# Altium schematic sheet 25_Clocks_1.SchDoc: Clocks 1
size A3; Organization: Lime Microsystems; Address1: Surrey Tech Centre; Address2: Guildford GU2 7YG; Address3: Surrey; Address4: United Kingdom; Revision: v1.2; SheetNumber: 23; SheetTotal: 27
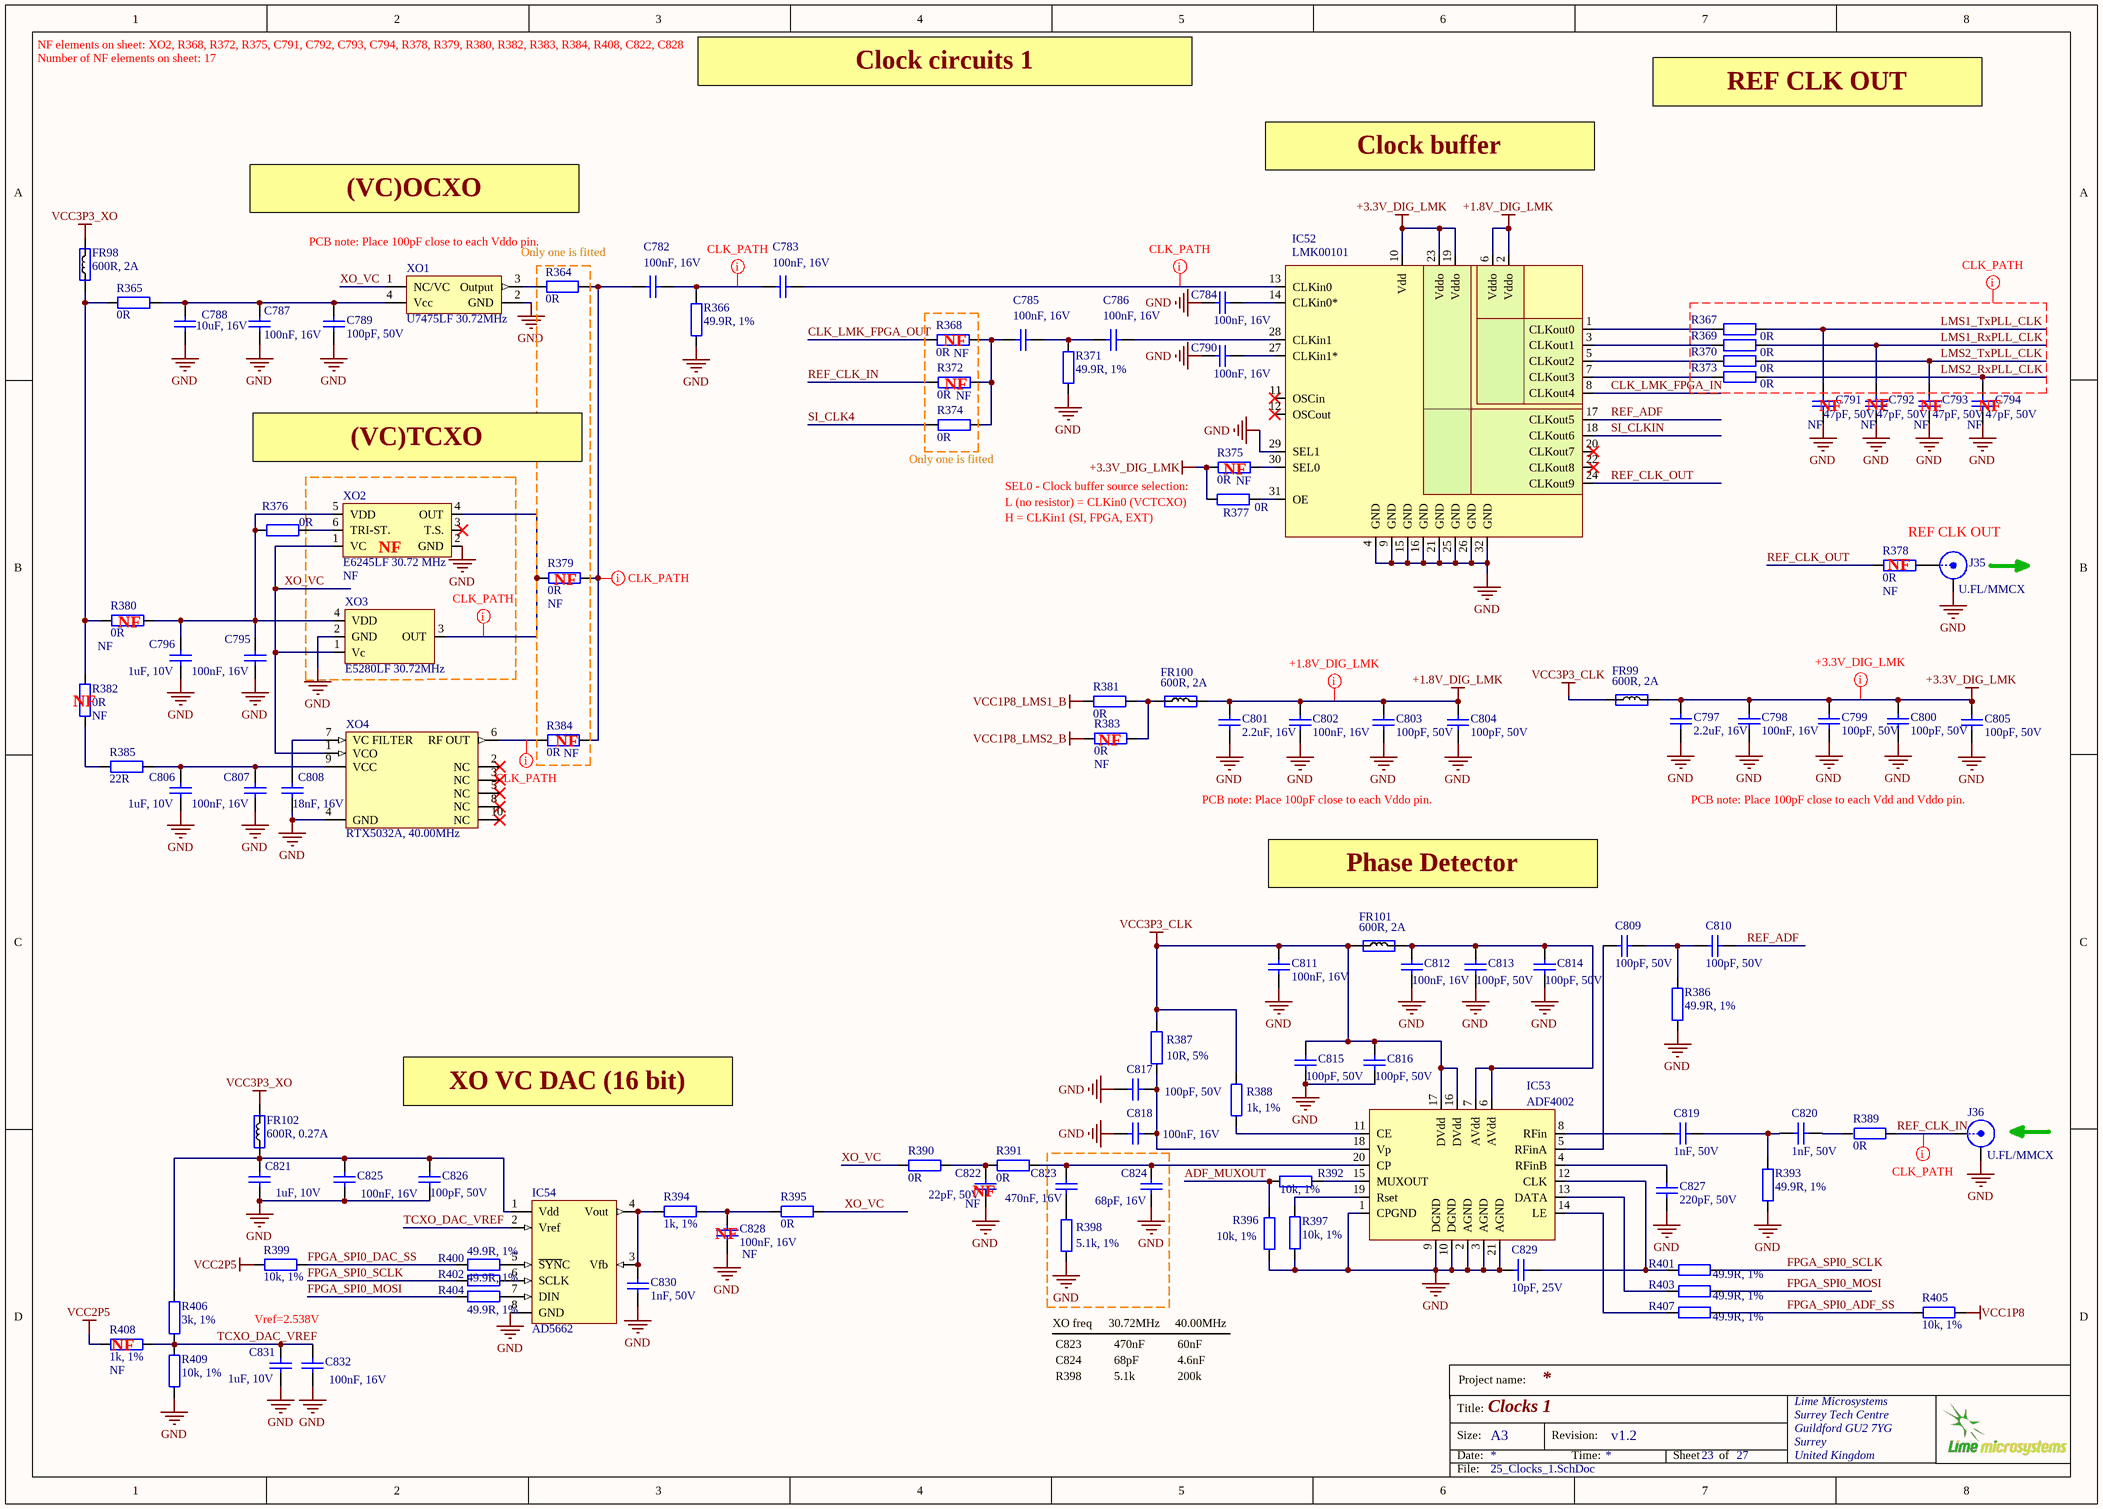
[diagram p0: 25_Clocks_1.SchDoc]

## Parts
C782  100nF, 16V  [CAP0402]
C783  100nF, 16V  [CAP0402]
C784  100nF, 16V  [CAP0402]
C785  100nF, 16V  [CAP0402]
C786  100nF, 16V  [CAP0402]
C787  100nF, 16V  [CAP0402]
C788  10uF, 16V  [CAP0603]
C789  100pF, 50V  [CAP0402]
C790  100nF, 16V  [CAP0402]
C791  47pF, 50V  Assembly Info: NF  [CAP0402]
C792  47pF, 50V  Assembly Info: NF  [CAP0402]
C793  47pF, 50V  Assembly Info: NF  [CAP0402]
C794  47pF, 50V  Assembly Info: NF  [CAP0402]
C795  100nF, 16V  [CAP0402]
C796  1uF, 10V  [CAP0402]
C797  2.2uF, 16V  [CAP0402]
C798  100nF, 16V  [CAP0402]
C799  100pF, 50V  [CAP0402]
C800  100pF, 50V  [CAP0402]
C801  2.2uF, 16V  [CAP0402]
C802  100nF, 16V  [CAP0402]
C803  100pF, 50V  [CAP0402]
C804  100pF, 50V  [CAP0402]
C805  100pF, 50V  [CAP0402]
C806  1uF, 10V  [CAP0402]
C807  100nF, 16V  [CAP0402]
C808  18nF, 16V  [CAP0402]
C809  100pF, 50V  [CAP0402]
C810  100pF, 50V  [CAP0402]
C811  100nF, 16V  [CAP0402]
C812  100nF, 16V  [CAP0402]
C813  100pF, 50V  [CAP0402]
C814  100pF, 50V  [CAP0402]
C815  100pF, 50V  [CAP0402]
C816  100pF, 50V  [CAP0402]
C817  100pF, 50V  [CAP0402]
C818  100nF, 16V  [CAP0402]
C819  1nF, 50V  [CAP0402]
C820  1nF, 50V  [CAP0402]
C821  1uF, 10V  [CAP0402]
C822  22pF, 50V  Assembly Info: NF  [CAP0402]
C823  470nF, 16V  [CAP0402]
C824  68pF, 16V  [CAP0402]
C825  100nF, 16V  [CAP0402]
C826  100pF, 50V  [CAP0402]
C827  220pF, 50V  [CAP0402]
C828  100nF, 16V  Assembly Info: NF  [CAP0402]
C829  10pF, 25V  [CAP0402]
C830  1nF, 50V  [CAP0402]
C831  1uF, 10V  [CAP0402]
C832  100nF, 16V  [CAP0402]
FR98  600R, 2A  [RES0805]
FR99  600R, 2A  [RES0805]
FR100  600R, 2A  [RES0805]
FR101  600R, 2A  [RES0805]
FR102  value 600R, 0.27A  [RES0201]  (hidden comment: Ferrite)
IC52  LMK00101  [LMK00101_WQFN32]
IC53  ADF4002  [ADF4002]
IC54  AD5662  [AD5662_SOT23-8]
J35  U.FL/MMCX  [MMCX_UFL_conn_u]
J36  U.FL/MMCX  [MMCX_UFL_conn_u]
R364  0R  [RES0402_v2]
R365  0R  [RES0402]
R366  49.9R, 1%  [RES0402]
R367  0R  [RES0402]
R368  0R  Assembly Info: NF  [RES0402_v2]
R369  0R  [RES0402]
R370  0R  [RES0402]
R371  49.9R, 1%  [RES0402]
R372  0R  Assembly Info: NF  [RES0402_v2]
R373  0R  [RES0402]
R374  0R  [RES0402_v2]
R375  0R  Assembly Info: NF  [RES0402]
R376  0R  [RES0402]
R377  0R  [RES0402]
R378  0R  Assembly Info: NF  [RES0402]
R379  0R  Assembly Info: NF  [RES0402_v2]
R380  0R  Assembly Info: NF  [RES0402]
R381  0R  [RES0402]
R382  0R  Assembly Info: NF  [RES0402]
R383  0R  Assembly Info: NF  [RES0402]
R384  0R  Assembly Info: NF  [RES0402_v2]
R385  22R  [RES0402]
R386  49.9R, 1%  [RES0402]
R387  10R, 5%  [RES0402]
R388  1k, 1%  [RES0402]
R389  0R  [RES0402_v2]
R390  0R  [RES0402]
R391  0R  [RES0402]
R392  10k, 1%  [RES0402]
R393  49.9R, 1%  [RES0402]
R394  1k, 1%  [RES0402]
R395  0R  [RES0402]
R396  10k, 1%  [RES0402]
R397  10k, 1%  [RES0402]
R398  5.1k, 1%  [RES0402]
R399  10k, 1%  [RES0402]
R400  49.9R, 1%  [RES0402]
R401  49.9R, 1%  [RES0402]
R402  49.9R, 1%  [RES0402]
R403  49.9R, 1%  [RES0402]
R404  49.9R, 1%  [RES0402]
R405  10k, 1%  [RES0402]
R406  3k, 1%  [RES0402]
R407  49.9R, 1%  [RES0402]
R408  1k, 1%  Assembly Info: NF  [RES0402]
R409  10k, 1%  [RES0402]
XO1  U7475LF 30.72MHz  [AOCJYR-10.000MHz]
XO2  E6245LF 30.72 MHz  Assembly Info: NF  [RAKON_RPT7050A]
XO3  E5280LF 30.72MHz  [RAKON_TXCO]
XO4  RTX5032A, 40.00MHz  [RAKON_RTX5032A]

## Nets
+1.8V_DIG_LMK: C801.2 C802.2 C803.2 C804.2 FR100.2 IC52.2(Vddo) IC52.6(Vddo)
+3.3V_DIG_LMK: C797.2 C798.2 C799.2 C800.2 C805.2 FR99.2 IC52.10(Vdd) IC52.19(Vddo) IC52.23(Vddo) R375.2 R377.1
GND: C784.1 C787.1 C788.1 C789.2 C790.1 C791.1 C792.1 C793.1 C794.1 C795.1 C796.1 C797.1 C798.1 C799.1 C800.1 C801.1 C802.1 C803.1 C804.1 C805.1 C806.1 C807.1 C808.1 C811.1 C812.1 C813.2 C814.2 C815.2 C816.2 C817.1 C818.2 C821.1 C822.1 C824.1 C825.2 C826.2 C827.2 C828.1 C829.1 C830.2 C831.1 C832.2 IC52.4(GND) IC52.9(GND) IC52.15(GND) IC52.16(GND) IC52.21(GND) IC52.25(GND) IC52.26(GND) IC52.29(SEL1) IC52.32(GND) IC53.1(CPGND) IC53.2(AGND) IC53.3(AGND) IC53.9(DGND) IC53.10(DGND) IC53.21(AGND) IC54.8(GND) J35.2(Y) J36.2(Y) R366.1 R371.1 R386.1 R393.1 R396.2 R397.2 R398.1 R409.2 XO1.2(GND) XO2.2(GND) XO3.2(GND) XO4.4(GND)
VCC1P8: R405.2
VCC1P8_LMS1_B: R381.1
VCC1P8_LMS2_B: R383.2
VCC2P5: R399.2 R408.2
VCC3P3_CLK: C811.2 C815.1 C816.1 FR99.1 FR101.1 IC53.16(DVdd) IC53.17(DVdd) R387.2 R388.2
VCC3P3_XO: FR98.1 FR102.2
ADF_MUXOUT: R392.1 R396.1
CLK_LMK_FPGA_IN: IC52.8(CLKout4)
CLK_LMK_FPGA_OUT: R368.1
FPGA_SPI0_ADF_SS: R405.1 R407.1
FPGA_SPI0_DAC_SS: R399.1 R400.2
FPGA_SPI0_MOSI: R403.1 R404.2
FPGA_SPI0_SCLK: R401.1 R402.2
LMS1_RxPLL_CLK: C792.2 R369.1
LMS1_TxPLL_CLK: C791.2 R367.1
LMS2_RxPLL_CLK: C794.2 R373.1
LMS2_TxPLL_CLK: C793.2 R370.1
REF_ADF: C810.2 IC52.17(CLKout5)
REF_CLK_IN: J36.1(X) R372.2 R389.1
REF_CLK_OUT: IC52.24(CLKout9) R378.2
SI_CLK4: R374.2
SI_CLKIN: IC52.18(CLKout6)
TCXO_DAC_VREF: C831.2 C832.1 IC54.2(Vref) R406.1 R408.1 R409.1
XO_VC: R390.2 R395.1 XO1.1(NC/VC) XO2.1(VC) XO3.1(Vc) XO4.1(VCO)
NetC782_1: C782.1 C783.2 R366.2
NetC782_2: C782.2 R364.1 R379.1 R384.2
NetC783_1: C783.1 IC52.13(CLKin0)
NetC784_2: C784.2 IC52.14(CLKin0*)
NetC785_1: C785.1 C786.2 R371.2
NetC785_2: C785.2 R368.2 R372.1 R374.1
NetC786_1: C786.1 IC52.28(CLKin1)
NetC787_2: C787.2 C788.2 C789.1 R365.2 XO1.4(Vcc)
NetC790_2: C790.2 IC52.27(CLKin1*)
NetC795_2: C795.2 C796.2 R376.2 R380.1 XO2.5(VDD) XO3.4(VDD)
NetC806_2: C806.2 C807.2 R385.2 XO4.9(VCC)
NetC808_2: C808.2 XO4.7(VC_FILTER)
NetC809_1: C809.1 IC53.5(RFinA)
NetC809_2: C809.2 C810.1 R386.2
NetC812_2: C812.2 C813.1 C814.1 FR101.2 IC53.6(AVdd) IC53.7(AVdd)
NetC817_2: C817.2 C818.1 IC53.18(Vp) R387.1
NetC819_1: C819.1 C820.2 R393.2
NetC819_2: C819.2 IC53.8(RFin)
NetC820_1: C820.1 R389.2
NetC821_2: C821.2 C825.1 C826.1 FR102.1 IC54.1(Vdd) R406.2
NetC822_2: C822.2 R390.1 R391.2
NetC823_1: C823.1 R398.2
NetC823_2: C823.2 C824.2 IC53.20(CP) R391.1
NetC827_1: C827.1 IC53.4(RFinB)
NetC828_2: C828.2 R394.1 R395.2
NetC829_2: C829.2 IC53.12(CLK) R401.2
NetC830_1: C830.1 IC54.3(Vfb) IC54.4(Vout) R394.2
NetFR98_2: FR98.2 R365.1 R380.2 R382.1
NetFR100_1: FR100.1 R381.2 R383.1
NetIC52_1: IC52.1(CLKout0) R367.2
NetIC52_3: IC52.3(CLKout1) R369.2
NetIC52_5: IC52.5(CLKout2) R370.2
NetIC52_7: IC52.7(CLKout3) R373.2
NetIC52_30: IC52.30(SEL0) R375.1
NetIC52_31: IC52.31(OE) R377.2
NetIC53_11: IC53.11(CE) R388.1
NetIC53_13: IC53.13(DATA) R403.2
NetIC53_14: IC53.14(LE) R407.2
NetIC53_15: IC53.15(MUXOUT) R392.2
NetIC53_19: IC53.19(Rset) R397.1
NetIC54_5: IC54.5(~{SYN}C) R400.1
NetIC54_6: IC54.6(SCLK) R402.1
NetIC54_7: IC54.7(DIN) R404.1
NetJ35_1: J35.1(X) R378.1
NetR364_2: R364.2 XO1.3(Output)
NetR376_1: R376.1 XO2.6(TRI-ST.)
NetR379_2: R379.2 XO2.4(OUT) XO3.3(OUT)
NetR382_2: R382.2 R385.1
NetR384_1: R384.1 XO4.6(RF_OUT)

Not connected (* = marked no-connect by the designer): IC52 11(OSCin)* 12(OSCout)* 20(CLKout7)* 22(CLKout8)*; XO2 3(T.S.)*; XO4 2(NC)* 3(NC)* 5(NC)* 8(NC)* 10(NC)*

## Layout directives
net class CLK_PATH: LMS1_RxPLL_CLK, LMS1_TxPLL_CLK, LMS2_RxPLL_CLK, LMS2_TxPLL_CLK, NetC782_1, NetC782_2, NetC783_1, NetR379_2, NetR384_1, REF_CLK_IN
net class +1.8V_DIG_LMK: +1.8V_DIG_LMK
net class +3.3V_DIG_LMK: +3.3V_DIG_LMK

## Notes on the sheet
- NF elements on sheet: XO2, R368, R372, R375, C791, C792, C793, C794, R378, R379, R380, R382, R383, R384, R408, C822, C828
- Number of NF elements on sheet: 17
- Clock circuits 1
- REF CLK OUT
- Clock buffer
- (VC)OCXO
- PCB note: Place 100pF close to each Vddo pin.
- Only one is fitted
- (near R368) NF
- (near R372) NF
- (near C791) NF
- (near C792) NF
- (near C793) NF
- (near C794) NF
- (VC)TCXO
- (near R374) Only one is fitted
- (near R377) L (no resistor) = CLKin0 (VCTCXO)
- (near R377) SEL0 - Clock buffer source selection:
- (near R375) NF
- (near XO2) NF
- (near R379) NF
- H = CLKin1 (SI, FPGA, EXT)
- (near R378) NF
- (near R380) NF
- (near R382) NF
- (near R384) NF
- (near R383) NF
- PCB note: Place 100pF close to each Vdd and Vddo pin.
- Phase Detector
- XO VC DAC (16 bit)
- (near C828) NF
- (near C822) NF
- Vref=2.538V
- XO freq
- 30.72MHz
- 40.00MHz
- (near R408) NF
- C824
- R398
- C823
- 68pF
- 5.1k
- 470nF
- 4.6nF
- 200k
- 60nF
- Project name:
- Title:
- Size:
- Date:
- A3
- Revision:
- Time:
- Sheet
- of
- File:

## Library data of the parts
C782-C787 C790 C795 C798 C802 C807 C811 C812 C818 C828 = Cap_0402: Manufacturer: Murata Electronics; Manufacturer Part Number: GRM155R71C104KA88D; Part Description: 0.10µF ±10% 16V Ceramic Capacitor X7R 0402 (1005 Metric); Tolerance: 10 %; Type: General Purpose MLCC; Capacitance: 0.1 uF; Case Length: 1 mm; Dielectric: X7R; Case Height: 0.5 mm; Temperature Coefficient / Code: +/- 15 %; Value: 100nF, 16V; Supplier 1: Mouser; Supplier Part Number 1: 81-GRM155R71C104KA88; Case Code - in: 0402; RoHS: RoHS Compliant; Operating Temperature Range: - 55 C to + 125 C; Series: GRM; Termination Style: SMD/SMT; Package / Case: 0402 (1005 metric); Voltage Rating DC: 16 V; Maximum Operating Temperature: + 125 C; Case Code - mm: 1005; Minimum Operating Temperature: - 55 C; Product Category: Low & Medium Capacitance SMD Ceramic Chip Capacitors; Packaging: Reel; Product: General Type MLCCs; Category: Multilayer Ceramic Capacitors MLCC - SMD/SMT; Brand: Murata Electronics; Case Width: 0.5 mm; RoHS - Mouser: Y; Standard Pack Qty: 10000; Minimum Order Quantity: 1; Reeling: True; Manufacturer Part Number 1: GRM155R71C104KA88D
C788 = Cap_0603: Manufacturer: Yageo; Manufacturer Part Number 1: GRM188R61C106MA73D; Part Description: 10µF ±20% 16V Ceramic Capacitor X5R 0603 (1608 Metric); Temperature Coefficient: X5R; Capacitance: 10µF; Tolerance: ±20%; Value: 10uF, 16V; Supplier 1: Digi-Key; Supplier Part Number 1: 490-7201-2-ND; Category: Capacitors; Ratings: -; Features: -; Lead Style: -; Package / Case: 0603 (1608 Metric); Lead Spacing: -; Applications: General Purpose; Voltage - Rated: 16V; Operating Temperature: -55°C ~ 85°C; Thickness (Max): 0.039" (1.00mm); Mounting Type: Surface Mount, MLCC; RoHS: RoHS Compliant; Size / Dimension: 0.063" L x 0.031" W (1.60mm x 0.80mm); Packaging: Tape & Reel (TR); Height - Seated (Max): -
C789 = Cap_0402: Manufacturer Part Number 1: CC0402JRNPO9BN101; Manufacturer: Yageo; Part Description: 100pF ±5% 50V C0G, NP0 Ceramic Capacitor -55°C ~ 125°C Surface Mount, MLCC 0402 (1005 Metric) 0.039" L x 0.020" W (1.00mm x 0.50mm); Tolerance: ±5%; Temperature Coefficient: C0G, NP0; Value: 100pF, 50V; Capacitance: 100pF; Thickness (Max): 0.022" (0.55mm); Size / Dimension: 0.039" L x 0.020" W (1.00mm x 0.50mm); RoHS: RoHS Compliant; Ratings: -; Package / Case: 0402 (1005 Metric); Mounting Type: Surface Mount, MLCC; Height - Seated (Max): -; Features: -; Lead Spacing: -; Voltage - Rated: 50V; Operating Temperature: -55°C ~ 125°C; Packaging: Cut Tape (CT); Applications: General Purpose; Lead Style: -; Supplier 1: Digi-Key; Category: Capacitors; Supplier Part Number 1: 311-1024-1-ND
C791-C794 = Cap_0402: Manufacturer Part Number 1: C1005C0G1H470F050BA; Manufacturer: TDK Corporation; Part Description: 47pF ±1% 50V Ceramic Capacitor C0G, NP0 0402 (1005 Metric); Temperature Coefficient: C0G, NP0; Tolerance: ±1%; Value: 47pF, 50V; Supplier 1: Digi-Key; Supplier Part Number 1: 445-5361-1-ND; Package / Case: 0402 (1005 Metric); Voltage - Rated: 50V; Lead Spacing: -; Ratings: -; Mounting Type: Surface Mount, MLCC; Operating Temperature: -55°C ~ 125°C; Thickness (Max): 0.022" (0.55mm); Capacitance: 47pF; Packaging: Cut Tape (CT); Features: -; Applications: General Purpose; Lead Style: -; Size / Dimension: 0.039" L x 0.020" W (1.00mm x 0.50mm); Height - Seated (Max): -; RoHS: RoHS Compliant; Category: Capacitors
C796 C806 C821 C831 = Cap_0402: Manufacturer Part Number 1: GRM155R61A105KE15J; Manufacturer: TDK; Part Description: 1µF ±10% 10V Ceramic Capacitor X5R 0402 (1005 Metric); Voltage Rating: 10; Capacitance Tolerance: ± 10%; Product Range: TDK - C Series; Ceramic Capacitor Case: 0402 [1005 Metric]; Capacitance: 1; Dielectric Characteristic: X6; Value: 1uF, 10V; Supplier 1: Newark; Supplier Part Number 1: 490-6298-2-ND; MSL: -; RoHS: YES
C797 C801 = Cap_0402: CAP CER 2.2UF 16V 10% X5R 0402; Manufacturer Part Number 1: C1005X5R1C225K050BC; Manufacturer: TDK Corporation; Part Description: 2.2µF ±10% 16V Ceramic Capacitor X5R 0402 (1005 Metric); Capacitance: 2.2µF; Tolerance: ±20%; Capacitor Case Style: 0402 [1005 Metric]; Value: 2.2uF, 16V; Supplier 1: Digi-Key; Supplier Part Number 1: 445-9085-6-ND; Category: Capacitors; Voltage - Rated: 16V; Thickness (Max): 0.022" (0.55mm); Applications: General Purpose; Package / Case: 0402 (1005 Metric); Size / Dimension: 0.039" L x 0.020" W (1.00mm x 0.50mm); Features: -; Temperature Coefficient: X5R; Mounting Type: Surface Mount, MLCC; Ratings: -; Lead Style: -; Operating Temperature: -55°C ~ 85°C; Lead Spacing: -; RoHS: RoHS Compliant; Height - Seated (Max): -; Packaging: Tape & Reel (TR); Operating Temperature Range: -55°C to +85
C799 C800 C803-C805 = Cap_0402: Manufacturer Part Number 1: CC0402JRNPO9BN101; Manufacturer: Yageo; Part Description: 100pF ±5% 50V C0G, NP0 Ceramic Capacitor -55°C ~ 125°C Surface Mount, MLCC 0402 (1005 Metric) 0.039" L x 0.020" W (1.00mm x 0.50mm); Temperature Coefficient: C0G, NP0; Tolerance: ±5%; Value: 100pF, 50V; Supplier 1: Digi-Key; Supplier Part Number 1: 311-1024-1-ND; RoHS: RoHS Compliant; Category: Capacitors; Applications: General Purpose; Mounting Type: Surface Mount, MLCC; Capacitance: 100pF; Ratings: -; Packaging: Cut Tape (CT); Voltage - Rated: 50V; Size / Dimension: 0.039" L x 0.020" W (1.00mm x 0.50mm); Height - Seated (Max): -; Package / Case: 0402 (1005 Metric); Operating Temperature: -55°C ~ 125°C; Features: -; Lead Spacing: -; Lead Style: -; Thickness (Max): 0.022" (0.55mm)
C808 = Cap_0402: Manufacturer: Yageo; Manufacturer Part Number 1: CC0402KRX7R7BB183; Part Description: 0.018µF ±10% 16V Ceramic Capacitor X7R 0402 (1005 Metric); Temperature Coefficient: X7R; Capacitance: 0.018µF; Tolerance: ±10%; Value: 18nF, 16V; Supplier 1: Digi-Key; Supplier Part Number 1: 311-1706-1-ND; Part Status: Active; Category: Capacitors; Packaging: Cut Tape (CT); Voltage - Rated: 16V; RoHS: RoHS Compliant; Size / Dimension: 0.039" L x 0.020" W (1.00mm x 0.50mm); Package / Case: 0402 (1005 Metric); Mounting Type: Surface Mount, MLCC; Thickness (Max): 0.022" (0.55mm); Applications: General Purpose; Operating Temperature: -55°C ~ 125°C
C809 C810 C813-C817 C826 = Cap_0402: Manufacturer: Yageo; Manufacturer Part Number 1: CC0402JRNPO9BN101; Part Description: 100pF ±5% 50V C0G, NP0 Ceramic Capacitor -55°C ~ 125°C Surface Mount, MLCC 0402 (1005 Metric) 0.039" L x 0.020" W (1.00mm x 0.50mm); Temperature Coefficient: C0G, NP0; Tolerance: ±5%; Value: 100pF, 50V; Supplier 1: Digi-Key; Supplier Part Number 1: 311-1024-1-ND; Category: Capacitors; Features: -; Operating Temperature: -55°C ~ 125°C; Capacitance: 100pF; Thickness (Max): 0.022" (0.55mm); RoHS: RoHS Compliant; Voltage - Rated: 50V; Lead Style: -; Ratings: -; Size / Dimension: 0.039" L x 0.020" W (1.00mm x 0.50mm); Height - Seated (Max): -; Applications: General Purpose; Package / Case: 0402 (1005 Metric); Lead Spacing: -; Packaging: Tape & Reel (TR); Mounting Type: Surface Mount, MLCC
C819 C820 C830 = Cap_0402: Manufacturer Part Number 1: GCM155R71H102KA37D; Part Description: 1000pF ±10% 50V Ceramic Capacitor X7R 0402 (1005 Metric); Capacitance: 1000 pF; Type: Automotive Ultra Small MLCC; Tolerance: 10 %; Brand: Murata Electronics; Case Height: 0.5 mm; Case Length: 1 mm; Dielectric: X7R; Temperature Coefficient / Code: +/- 15 %; Value: 1nF, 50V; Supplier 1: Mouser; Supplier Part Number 1: 81-GCM155R71H102KA7D; Case Code - in: 0402; Package / Case: 0402 (1005 metric); Termination Style: SMD/SMT; Packaging: Reel; Operating Temperature Range: - 55 C to + 125 C; Maximum Operating Temperature: + 125 C; Manufacturer: Murata Electronics; Category: Multilayer Ceramic Capacitors MLCC - SMD/SMT; RoHS: RoHS Compliant; Series: GCM; Case Width: 0.5 mm; Voltage Rating DC: 50 V; Case Code - mm: 1005; Product: Automotive MLCCs; Standard Pack Qty: 10000; Reeling: True; RoHS - Mouser: Y; Minimum Order Quantity: 1; Product Category: Automotive Ceramic Chip Capacitors; Minimum Operating Temperature: - 55 C
C822 = Cap_0402: Manufacturer: Yageo; Manufacturer Part Number 1: CC0402JRNPO9BN220; Part Description: 22pF ±5% 50V Ceramic Capacitor C0G, NP0 0402 (1005 Metric); Tolerance: ±5%; Temperature Coefficient: C0G, NP0; Value: 22pF, 50V; Supplier 1: Digi-Key; Supplier Part Number 1: 311-1018-2-ND; Category: Capacitors; Voltage - Rated: 50V; Packaging: Tape & Reel (TR); RoHS: RoHS Compliant; Capacitance: 22pF; Operating Temperature: -55°C ~ 125°C; Mounting Type: Surface Mount, MLCC; Height - Seated (Max): -; Size / Dimension: 0.039" L x 0.020" W (1.00mm x 0.50mm); Ratings: -; Applications: General Purpose; Thickness (Max): 0.022" (0.55mm); Lead Spacing: -; Lead Style: -; Features: -; Package / Case: 0402 (1005 Metric)
C823 = Cap_0402: Part Description: 0.47µF -20%, +80% 16V Ceramic Capacitor Y5V (F) 0402 (1005 Metric); Manufacturer: Yageo; Manufacturer Part Number 1: CC0402ZRY5V7BB474; Tolerance: -20%, +80%; Temperature Coefficient: Y5V (F); Value: 470nF, 16V; Supplier 1: Digi-Key; Supplier Part Number 1: 311-1735-1-ND; RoHS: RoHS Compliant; Category: Capacitors; Stock 1: 120918; Pricing 1: 1=0.1, 10=0.047, 100=0.0211, 500=0.0151, 1000=0.01186, 2500=0.01078, 5000=0.00992 (USD); Packaging: Cut Tape (CT); Part Status: Active; Voltage - Rated: 16V; Operating Temperature: -30°C ~ 85°C; Features: -; Ratings: -; Applications: General Purpose; Failure Rate: -; Mounting Type: Surface Mount, MLCC; Package / Case: 0402 (1005 Metric); Size / Dimension: 0.039" L x 0.020" W (1.00mm x 0.50mm); Height - Seated (Max): -; Thickness (Max): 0.022" (0.55mm); Lead Spacing: -; Lead Style: -; ComponentLink1URL: http://www.yageo.com/documents/recent/UPY-GPHC_Y5V_6.3V-to-50V_8.pdf; ComponentLink1Description: http://www.yageo.com/documents/recent/UPY-GPHC_Y5V_6.3V-to-50V_8.pdf
C824 = Cap_0402: Part Description: 68pF ±5% 16V Ceramic Capacitor C0G, NP0 0402 (1005 Metric); Manufacturer: Wurth Electronics Inc.; Manufacturer Part Number 1: 885012005030; Tolerance: ±5%; Temperature Coefficient: C0G, NP0; Value: 68pF, 16V; Supplier 1: Digi-Key; Supplier Part Number 1: 732-7446-1-ND; RoHS: RoHS Compliant; Category: Capacitors; Stock 1: 7896; Pricing 1: 1=0.1, 50=0.056, 100=0.045, 250=0.03404, 500=0.02802, 1000=0.02202 (USD); Packaging: Cut Tape (CT); Part Status: Active; Voltage - Rated: 16V; Operating Temperature: -55°C ~ 125°C; Features: -; Ratings: -; Applications: General Purpose; Mounting Type: Surface Mount, MLCC; Package / Case: 0402 (1005 Metric); Size / Dimension: 0.039" L x 0.020" W (1.00mm x 0.50mm); Height - Seated (Max): -; Thickness (Max): 0.022" (0.55mm); Lead Spacing: -; Lead Style: -; ComponentLink1URL: http://katalog.we-online.de/pbs/datasheet/885012005030.pdf; ComponentLink1Description: http://katalog.we-online.de/pbs/datasheet/885012005030.pdf
C825 C832 = Cap_0603: Manufacturer Part Number 1: GRM155R71C104KA88D; Part Description: 0.10µF ±10% 16V Ceramic Capacitor X7R 0402 (1005 Metric); Brand: Murata Electronics; Tolerance: 10 %; Type: General Purpose MLCC; Capacitance: 0.1 uF; Temperature Coefficient / Code: +/- 15 %; Case Height: 0.5 mm; Case Length: 1 mm; Dielectric: X7R; Supplier 1: Mouser; Supplier Part Number 1: 81-GRM155R71C104KA88; Case Code - in: 0402; Manufacturer: Murata Electronics; Category: Multilayer Ceramic Capacitors MLCC - SMD/SMT; Voltage Rating DC: 16 V; Value: 100nF, 16V; Manufacturer Part Number: GRM155R71C104KA88D; Case Code - mm: 1005; Case Width: 0.5 mm; Maximum Operating Temperature: + 125 C; Minimum Operating Temperature: - 55 C; Minimum Order Quantity: 1; Operating Temperature Range: - 55 C to + 125 C; Package / Case: 0402 (1005 metric); Packaging: Reel; Product: General Type MLCCs; Product Category: Low & Medium Capacitance SMD Ceramic Chip Capacitors; Reeling: True; RoHS - Mouser: Y; RoHS: RoHS Compliant; Series: GRM; Standard Pack Qty: 10000; Termination Style: SMD/SMT
C827 = Cap_0402: Manufacturer Part Number 1: CC0402KRX7R9BB221; Manufacturer: Yageo; Part Description: 220pF ±10% 50V Ceramic Capacitor X7R 0402 (1005 Metric); Temperature Coefficient: X7R; Tolerance: ±10%; Value: 220pF, 50V; Supplier 1: Digi-Key; Supplier Part Number 1: 311-1035-2-ND; Category: Capacitors; Ratings: -; Voltage - Rated: 50V; RoHS: RoHS Compliant; Packaging: Tape & Reel (TR); Mounting Type: Surface Mount, MLCC; Applications: General Purpose; Capacitance: 220pF; Operating Temperature: -55°C ~ 125°C; Package / Case: 0402 (1005 Metric); Lead Spacing: -; Size / Dimension: 0.039" L x 0.020" W (1.00mm x 0.50mm); Thickness (Max): 0.022" (0.55mm); Height - Seated (Max): -; Lead Style: -; Features: -
C829 = Cap_0402: Manufacturer Part Number 1: 04023A100JAT2A; Manufacturer: AVX; Part Description: 10pF ±5% 25V Ceramic Capacitor C0G, NP0 0402 (1005 Metric); Capacitance Tolerance: ± 5%; Voltage Rating: 25; Ceramic Capacitor Case: 0402 [1005 Metric]; Capacitor Case Style: 0402 [1005 Metric]<!--FANDB--><div class="features-and-benefits-container"></div>; Dielectric Characteristic: C0G / NP0; SVHC: No SVHC (16-Jun-2014); Capacitance: 10; Value: 10pF, 25V; Supplier 1: Farnell; Supplier Part Number 1: 2332478RL; Product Range: -; RoHS: YES; Operating Temperature Min: -55; Operating Temperature Max: 125; Capacitance Tolerance ±: ± 5%; MSL: MSL 1 - Unlimited; Packaging: Cut Tape
FR98 = Ferrite: Manufacturer Part Number 1: MPZ2012S601A; Manufacturer: TDK; Part Description: FERRITE BEAD 600 OHM 0805 1LN; DC Resistance (DCR): 100 mOhm Max; Filter Type: Differential Mode - Single; Impedance @ Frequency: 600 Ohm @ 100MHz; DC Current Rating: 2; DC Resistance Max: 0.1; Ferrite Case Style: 0805 [2012 Metric]; Ferrite Mounting: SMD; Impedance @ 100MHz: 600; Impedance Tolerance: ± 25%; Supplier 1: Farnell; Supplier Part Number 1: 1669753RL; Value: 600R, 2A; Category: Filters; Current Rating: 2A; Height (Max): 0.041" (1.05mm); Mounting Type: Surface Mount; Package / Case: 0805 (2012 Metric); Packaging: Tape & Reel (TR); RoHS: RoHS Compliant; Size / Dimension: 0.079" L x 0.049" W (2.00mm x 1.25mm); Core Material: Ferrite; Supplier: Farnell
FR99-FR101 = Ferrite: Manufacturer Part Number 1: MPZ2012S601A; Manufacturer: TDK; Part Description: FERRITE BEAD 600 OHM 0805 1LN; Filter Type: Differential Mode - Single; Impedance @ Frequency: 600 Ohm @ 100MHz; DC Resistance (DCR): 100 mOhm Max; DC Current Rating: 2; DC Resistance Max: 0.1; Ferrite Case Style: 0805 [2012 Metric]; Ferrite Mounting: SMD; Impedance @ 100MHz: 600; Impedance Tolerance: ± 25%; Supplier 1: Farnell; Supplier Part Number 1: 1669753RL; Mounting Type: Surface Mount; RoHS: RoHS Compliant; Height (Max): 0.041" (1.05mm); Packaging: Tape & Reel (TR); Category: Filters; Current Rating: 2A; Package / Case: 0805 (2012 Metric); Size / Dimension: 0.079" L x 0.049" W (2.00mm x 1.25mm); Value: 600R, 2A; Core Material: Ferrite; Supplier: Farnell
FR102 = Ferrite: Manufacturer Part Number 1: BK0603TS601-T; Manufacturer: Taiyo Yuden; Part Description: FERRITE BEAD 600 OHM 0201 1LN; DC Resistance (DCR): 750 mOhm Max; Filter Type: Differential Mode - Single; Impedance @ Frequency: 600 Ohm @ 100MHz; Current Rating: 270mA; Supplier 1: Digi-Key; Supplier Part Number 1: 587-3277-1-ND; Size / Dimension: 0.024" L x 0.012" W (0.60mm x 0.30mm); Package / Case: 0201 (0603 Metric); Height (Max): 0.013" (0.33mm); Mounting Type: Surface Mount; Packaging: Cut Tape (CT); RoHS: RoHS Compliant; Category: Filters
IC52 = LMK00101: Manufacturer: Texas Instruments; Manufacturer Part Number 1: LMK00101SQE/NOPB; Part Description: Clock Fanout Buffer (Distribution), Multiplexer, Translator IC 200MHz 32-WFQFN Exposed Pad; Input: HCSL, LVCMOS, LVDS, LVPECL, LVTTL, SSTL, Crystal; Frequency - Max: 200MHz; Output: LVCMOS, LVTTL; Ratio - Input:Output: 3:10; Number of Circuits: 1; Voltage - Supply: 2.375 V ~ 3.45 V; Differential - Input:Output: Yes/No; Supplier 1: Digi-Key; Mounting Type: Surface Mount; Package / Case: 32-WFQFN Exposed Pad; RoHS: RoHS Compliant; Operating Temperature: -40°C ~ 85°C; Type: Fanout Buffer (Distribution), Multiplexer, Translator; Category: Integrated Circuits (ICs); Packaging: Cut Tape (CT); Supplier Device Package: 32-WQFN (5x5); Supplier Part Number 1: 296-39036-1-ND
IC53 = ADF4002: Manufacturer: Analog Devices Inc; Manufacturer Part Number 1: ADF4002BCPZ-RL7; Part Description: IC PLL FREQUENCY SYNTH 20-LFCSP; Ratio - Input:Output: 2:1; Differential - Input:Output: Yes/No; Input: CMOS, TTL; Voltage - Supply: 2.7 V ~ 3.3 V; Supplier 1: Digi-Key; Supplier: Digi-Key; Category: Integrated Circuits (ICs); Type: Clock/Frequency Synthesizer (RF), Phase Detector; Operating Temperature: -40°C ~ 85°C; Mounting Type: Surface Mount; Package / Case: 20-VFQFN Exposed Pad, CSP; Supplier Part Number 1: ADF4002BCPZ-RL7CT-ND
IC54 = AD5662: Manufacturer: Analog Devices Inc.; Manufacturer Part Number 1: AD5662BRJZ-2REEL7; Part Description: IC DAC 16BIT BUFF V-OUT SOT23-8; Number of Bits: 16; Number of D/A Converters: 1; Settling Time: 10µs; Output Type: Voltage - Buffered; Differential Output: No; Data Interface: SPI, DSP; Reference Type: External; Voltage - Supply, Analog: 2.7 V ~ 5.5 V; INL/DNL (LSB): ±8, ±1 (Max); Architecture: String DAC; Supplier 1: Digi-Key; RoHS: RoHS Compliant; Category: Integrated Circuits (ICs); Stock 1: 2784; Pricing 1: 1=7.55, 10=6.821, 100=5.6469, 500=4.91722, 1000=4.28274 (USD); Packaging: Cut Tape (CT); Part Status: Active; Voltage - Supply, Digital: 2.7 V ~ 5.5 V; Operating Temperature: -40°C ~ 125°C; Package / Case: SOT-23-8; Supplier Device Package: SOT-23-8; ComponentLink1URL: http://www.analog.com/media/en/technical-documentation/data-sheets/AD5662.pdf; ComponentLink1Description: http://www.analog.com/media/en/technical-documentation/data-sheets/AD5662.pdf; Supplier Part Number 1: AD5662BRJZ-2REEL7CT-ND
J35 = RF_IF_connector: Manufacturer: Molex, LLC; Manufacturer Part Number 1: 0734120110; Part Description: Ultra Miniature Coaxial Connector Receptacle, Male Pin 50 Ohm Surface Mount Solder; Shield Termination: Solder; Frequency - Max: 6GHz; Impedance: 50 Ohm; Center Contact Material: Brass; Connector Style: Ultra Miniature Coaxial; Connector Type: Jack, Male Pin; Dielectric Material: Liquid Crystal Polymer (LCP); Center Contact Plating: Gold; Body Finish: Nickel; Body Material: Phosphor Bronze; Voltage Rating: 60V; Supplier 1: Digi-Key; Supplier Part Number 1: WM5587CT-ND; Ingress Protection: -; Category: Connectors, Interconnects; Mounting Type: Surface Mount; Packaging: Cut Tape (CT); Operating Temperature: -40°C ~ 90°C; Housing Color: Silver; Features: -; RoHS: RoHS Compliant; Cable Group: -; Fastening Type: Snap-On; Contact Termination: Solder
J36 = RF_IF_connector: CONN UMC RCPT STR 50 OHM SMD; Manufacturer: Molex, LLC; Manufacturer Part Number 1: 0734120110; Part Description: Ultra Miniature Coaxial Connector Receptacle, Male Pin 50 Ohm Surface Mount Solder; Shield Termination: Solder; Frequency - Max: 6GHz; Impedance: 50 Ohm; Center Contact Material: Brass; Connector Style: Ultra Miniature Coaxial; Connector Type: Jack, Male Pin; Dielectric Material: Liquid Crystal Polymer (LCP); Center Contact Plating: Gold; Body Finish: Nickel; Body Material: Phosphor Bronze; Voltage Rating: 60V; Supplier 1: Digi-Key; Supplier Part Number 1: WM5587CT-ND; Ingress Protection: -; Category: Connectors, Interconnects; Mounting Type: Surface Mount; Packaging: Cut Tape (CT); Operating Temperature: -40°C ~ 90°C; Housing Color: Silver; Features: -; RoHS: RoHS Compliant; Cable Group: -; Fastening Type: Snap-On; Contact Termination: Solder
R364 R365 R367-R370 R372-R384 R389-R391 R395 = Res_0402: Manufacturer Part Number 1: RC0402JR-070RL; Manufacturer: Yageo; Part Description: RES SMD 0.0OHM JUMPER 1/16W 0402; Resistance (Ohms): 0.0; Tolerance: Jumper; Power (Watts): 0.063W, 1/16W; Value: 0R; Supplier 1: Digi-Key; Supplier Part Number 1: 311-0.0JRTR-ND; Category: Resistors; Temperature Coefficient: -; Features: Moisture Resistant; Supplier Device Package: 0402; Height: 0.016" (0.40mm); Package / Case: 0402 (1005 Metric); Operating Temperature: -55°C ~ 155°C; Size / Dimension: 0.039" L x 0.020" W (1.00mm x 0.50mm); Composition: Thick Film; Packaging: Tape & Reel (TR); Number of Terminations: 2; RoHS: RoHS Compliant
R366 R371 R386 R393 R400-R404 R407 = Res_0402: Manufacturer: Samsung Electro-Mechanics America, Inc.; Part Description: RES SMD 49.9 OHM 1% 1/16W 0402; Manufacturer Part Number 1: RC1005F49R9CS; Temperature Coefficient: ±100ppm/°C; Resistance (Ohms): 49.9; Power (Watts): 0.063W, 1/16W; Number of Terminations: 2; Size / Dimension: 0.039" L x 0.020" W (1.00mm x 0.50mm); Supplier Device Package: 0402 (1005 Metric); RoHS: RoHS Compliant; Supplier Part Number 1: 1276-3469-6-ND; Features: -; Packaging: Digi-Reel®; Tolerance: ±1%; Height: 0.016" (0.40mm); Category: Resistors; Composition: Thick Film; Package / Case: 0402 (1005 Metric); Supplier 1: Digi-Key; Operating Temperature: -55°C ~ 155°C; Value: 49.9R, 1%
R385 = Res_0402: Part Description: RES SMD 22 OHM 1% 1/16W 0402; Manufacturer Part Number 1: RC0402FR-0722RL; Manufacturer: Yageo; Tolerance: ±1%; Temperature Coefficient: ±100ppm/°C; Resistance (Ohms): 22; Supplier 1: Digi-Key; Supplier Part Number 1: 311-22.0LRTR-ND; Supplier Device Package: 0402; Composition: Thick Film; Category: Resistors; Value: 22R
R387 = Res_0402: Manufacturer Part Number 1: RC0402JR-0710RL; Manufacturer: Yageo; Part Description: RES SMD 10 OHM 5% 1/16W 0402; Power (Watts): 0.063W, 1/16W; Resistance (Ohms): 10; Temperature Coefficient: ±200ppm/°C; Value: 10R, 5%; Supplier 1: Digi-Key; Supplier Part Number 1: 311-10JRTR-ND; Number of Terminations: 2; Height: 0.016" (0.40mm); RoHS: RoHS Compliant; Composition: Thick Film; Packaging: Tape & Reel (TR); Category: Resistors; Supplier Device Package: 0402; Features: Moisture Resistant; Tolerance: ±5%; Operating Temperature: -55°C ~ 155°C; Size / Dimension: 0.039" L x 0.020" W (1.00mm x 0.50mm); Package / Case: 0402 (1005 Metric)
R388 R394 R408 = Res_0402: Manufacturer: Stackpole Electronics Inc; Manufacturer Part Number 1: RMCF0402FT1K00; Part Description: RES SMD 1K OHM 1% 1/16W 0402; Temperature Coefficient: ±100ppm/°C; Power (Watts): 0.063W, 1/16W; Value: 1k, 1%; Supplier 1: Digi-Key; Supplier Part Number 1: RMCF0402FT1K00TR-ND; Resistance (Ohms): 1k; Packaging: Tape & Reel (TR); Category: Resistors; RoHS: RoHS Compliant; Tolerance: ±1%; Height: 0.016" (0.40mm); Number of Terminations: 2; Package / Case: 0402 (1005 Metric); Operating Temperature: -55°C ~ 155°C; Features: -; Composition: Thick Film; Supplier Device Package: 0402; Size / Dimension: 0.039" L x 0.020" W (1.00mm x 0.50mm)
R392 R396 R397 R399 R405 R409 = Res_0402: Manufacturer: Yageo; Manufacturer Part Number 1: RC0402FR-0710KL; Part Description: RES SMD 10K OHM 1% 1/16W 0402; Temperature Coefficient: ±100ppm/°C; Power (Watts): 0.063W, 1/16W; Value: 10k, 1%; Supplier 1: Digi-Key; Supplier Part Number 1: 311-10.0KLRTR-ND; Resistance (Ohms): 10k; Packaging: Tape & Reel (TR); RoHS: RoHS Compliant; Package / Case: 0402 (1005 Metric); Tolerance: ±1%; Operating Temperature: -55°C ~ 155°C; Size / Dimension: 0.039" L x 0.020" W (1.00mm x 0.50mm); Number of Terminations: 2; Category: Resistors; Height: 0.016" (0.40mm); Supplier Device Package: 0402; Features: Moisture Resistant; Composition: Thick Film
R398 = Res_0402: Part Description: 5.1 kOhms ±1% 0.063W, 1/16W Chip Resistor 0402 (1005 Metric) Moisture Resistant Thick Film; Manufacturer: Yageo; Manufacturer Part Number 1: RC0402FR-075K1L; Power (Watts): 0.063W, 1/16W; Temperature Coefficient: ±100ppm/°C; Value: 5.1k, 1%; Supplier 1: Digi-Key; Supplier Part Number 1: 311-5.10KLRCT-ND; RoHS: RoHS Compliant; Category: Resistors; Stock 1: 1186077; Pricing 1: 1=0.1, 10=0.014, 100=0.0056, 1000=0.00253, 2500=0.0022, 5000=0.00181 (USD); Packaging: Cut Tape (CT); Part Status: Active; Tolerance: ±1%; Composition: Thick Film; Features: Moisture Resistant; Operating Temperature: -55°C ~ 155°C; Package / Case: 0402 (1005 Metric); Supplier Device Package: 0402; Size / Dimension: 0.039" L x 0.020" W (1.00mm x 0.50mm); Height - Seated (Max): 0.016" (0.40mm); Failure Rate: -; ComponentLink1URL: http://www.yageo.com/documents/recent/PYu-RC_Group_51_RoHS_L_7.pdf; ComponentLink1Description: http://www.yageo.com/documents/recent/PYu-RC_Group_51_RoHS_L_7.pdf
R406 = Res_0402: Manufacturer: Vishay Dale; Part Description: RES SMD 3K OHM 1% 1/16W 0402; Manufacturer Part Number 1: CRCW04023K00FKED; Temperature Coefficient: ±100ppm/°C; Power (Watts): 0.063W, 1/16W; Value: 3k, 1%; Category: Resistors; Tolerance: ±1%; RoHS: RoHS Compliant; Composition: Thick Film; Number of Terminations: 2; Operating Temperature: -55°C ~ 155°C; Supplier Device Package: 0402 (1005 Metric); Supplier Part Number 1: 541-3.00KLCT-ND; Packaging: Cut Tape (CT); Supplier 1: Digi-Key; Package / Case: 0402 (1005 Metric); Features: Automotive AEC-Q200; Resistance (Ohms): 3k; Height: 0.016" (0.40mm); Size / Dimension: 0.039" L x 0.020" W (1.00mm x 0.50mm)
XO1 = AOCJYR-10.000MHz: Manufacturer: Rakon; Part Description: ROM9070SA 30.72MHz MERC+ 9x7 HOT RC2.5 3.3V PULL; Oscillator Output Compatibility: CMOS; Oscillator Case: SMD, 9.7mm x 7.5; Supply Voltage Nom: 3.3; Frequency Nom, MHz: 30.72; Frequency Stability +/-, ppb: 20; Manufacturer Part Number 1: U7475LF 30.72MHz; Supplier Part Number 1: 535-12623-1-ND; Supplier 1: Digi-key
XO2 = RPT7050A: Part Description: TCXO 30.72MHz, E6245LF; Manufacturer: Rakon; Manufacturer Part Number 1: E6245LF; Supplier 1: Rakon; Supplier Part Number 1: E6245LF
XO3 = TXCO: Part Description: TCXO 30.72MHz, E5280LF; Manufacturer: Rakon; Manufacturer Part Number 1: E5280LF; Supplier 1: Rakon; Supplier Part Number 1: E5280LF
XO4 = Rakon_RTX5032A: Part Description: RTX5032A 40MHz, High performance TCXO, With VC, Filter Enabled, 10-pin 5mm x 3.2 mm x 1.65 mm package; Manufacturer: Rakon; Manufacturer Part Number 1: RTX5032A; Supplier Part Number 1: RTX5032A; Supplier 1: RAKON